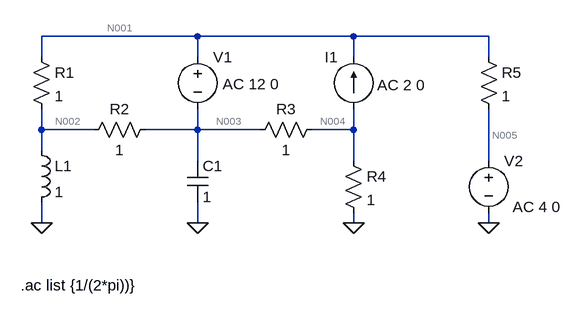
[diagram p0: schematic Irwin_Nelms_11e_8_56.asc]
Irwin_Nelms_11e_8_56.asc, the LTspice schematic file:
Version 4
SHEET 1 916 680
WIRE 352 64 112 64
WIRE 592 64 352 64
WIRE 800 64 592 64
WIRE 112 96 112 64
WIRE 352 96 352 64
WIRE 592 96 592 64
WIRE 800 96 800 64
WIRE 112 208 112 176
WIRE 192 208 112 208
WIRE 352 208 352 176
WIRE 352 208 272 208
WIRE 448 208 352 208
WIRE 592 208 592 176
WIRE 592 208 528 208
WIRE 112 240 112 208
WIRE 352 256 352 208
WIRE 592 256 592 208
WIRE 800 256 800 176
WIRE 112 352 112 320
WIRE 352 352 352 320
WIRE 592 352 592 336
WIRE 800 352 800 336
FLAG 112 352 0
FLAG 352 352 0
FLAG 592 352 0
FLAG 800 352 0
SYMBOL res 96 80 R0
SYMATTR InstName R1
SYMATTR Value 1
SYMBOL ind 96 224 R0
SYMATTR InstName L1
SYMATTR Value 1
SYMBOL res 288 192 R90
WINDOW 0 0 56 VBottom 2
WINDOW 3 32 56 VTop 2
SYMATTR InstName R2
SYMATTR Value 1
SYMBOL voltage 352 80 R0
WINDOW 123 39 58 Left 2
WINDOW 39 0 0 Left 0
SYMATTR InstName V1
SYMATTR Value ""
SYMATTR Value2 AC 12 0
SYMBOL cap 336 256 R0
SYMATTR InstName C1
SYMATTR Value 1
SYMBOL res 544 192 R90
WINDOW 0 0 56 VBottom 2
WINDOW 3 32 56 VTop 2
SYMATTR InstName R3
SYMATTR Value 1
SYMBOL res 576 240 R0
SYMATTR InstName R4
SYMATTR Value 1
SYMBOL res 784 80 R0
SYMATTR InstName R5
SYMATTR Value 1
SYMBOL voltage 800 240 R0
WINDOW 123 37 87 Left 2
WINDOW 39 0 0 Left 0
SYMATTR InstName V2
SYMATTR Value ""
SYMATTR Value2 AC 4 0
SYMBOL current 592 176 R180
WINDOW 0 24 80 Left 2
WINDOW 3 24 0 Left 2
WINDOW 123 -110 37 Left 2
WINDOW 39 0 0 Left 0
SYMATTR InstName I1
SYMATTR Value ""
SYMATTR Value2 AC 2 0
TEXT 80 448 Left 2 !.ac list {1/(2*pi))}

The netlist it stands for:
* Irwin_Nelms_11e_8_56.asc
R1 N001 N002 1
L1 N002 0 1
R2 N003 N002 1
V1 N001 N003 AC 12 0
C1 N003 0 1
R3 N004 N003 1
R4 N004 0 1
R5 N001 N005 1
V2 N005 0 AC 4 0
I1 N004 N001 AC 2 0
.ac list {1/(2*pi))}
.backanno
.end

* Results of the author's LTspice run, read from the files saved beside the schematic
* AC Analysis:
*   frequency = 1 
*   V(n001) = 11.88 V
*   V(n002) = 5.751 V
*   V(n003) = -122.9 mV
*   V(n004) = -1.061 V
*   V(n005) = 4 V
*   I(C1) = -7.068 A
*   I(L1) = 252 mA
*   I(I1) = 2 A
*   I(R5) = 7.877 A
*   I(R4) = -1.061 A
*   I(R3) = -938.6 mA
*   I(R2) = -5.874 A
*   I(R1) = 6.126 A
*   I(V2) = 7.877 A
*   I(V1) = -12 A